# EAGLE schematic UCube_v2_03 (EAGLE 6.1)
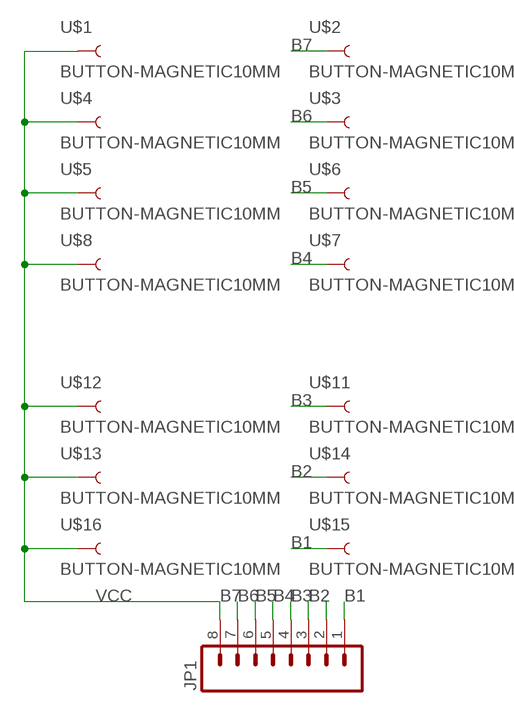
[diagram p0: schematic, sheet 1]

## Parts
JP1  M081X08  [1X08]
U$1  BUTTON-MAGNETIC10MM  [BUTTON-10MM]
U$2  BUTTON-MAGNETIC10MM  [BUTTON-10MM]
U$3  BUTTON-MAGNETIC10MM  [BUTTON-10MM]
U$4  BUTTON-MAGNETIC10MM  [BUTTON-10MM]
U$5  BUTTON-MAGNETIC10MM  [BUTTON-10MM]
U$6  BUTTON-MAGNETIC10MM  [BUTTON-10MM]
U$7  BUTTON-MAGNETIC10MM  [BUTTON-10MM]
U$8  BUTTON-MAGNETIC10MM  [BUTTON-10MM]
U$11  BUTTON-MAGNETIC10MM  [BUTTON-10MM]
U$12  BUTTON-MAGNETIC10MM  [BUTTON-10MM]
U$13  BUTTON-MAGNETIC10MM  [BUTTON-10MM]
U$14  BUTTON-MAGNETIC10MM  [BUTTON-10MM]
U$15  BUTTON-MAGNETIC10MM  [BUTTON-10MM]
U$16  BUTTON-MAGNETIC10MM  [BUTTON-10MM]

## Nets
B1: JP1.1 U$15.1
B2: JP1.2 U$14.1
B3: JP1.3 U$11.1
B4: JP1.4 U$7.1
B5: JP1.5 U$6.1
B6: JP1.6 U$3.1
B7: JP1.7 U$2.1
VCC: JP1.8 U$1.1 U$4.1 U$5.1 U$8.1 U$12.1 U$13.1 U$16.1

## Library data of the parts
JP1 = SparkFun2:M08: Header 8 Standard 8-pin 0.1" header. Use with straight break away headers (SKU : PRT-00116), right angle break away headers (PRT-00553), swiss pins (PRT-00743), machine pins (PRT-00117), and female headers (PRT-00115).
U$1-U$8 U$11-U$16 = SparkFun2:BUTTON-MAGNETIC